# EAGLE design ESP8266-EVB-BAT_Rev_B (EAGLE 4.16)
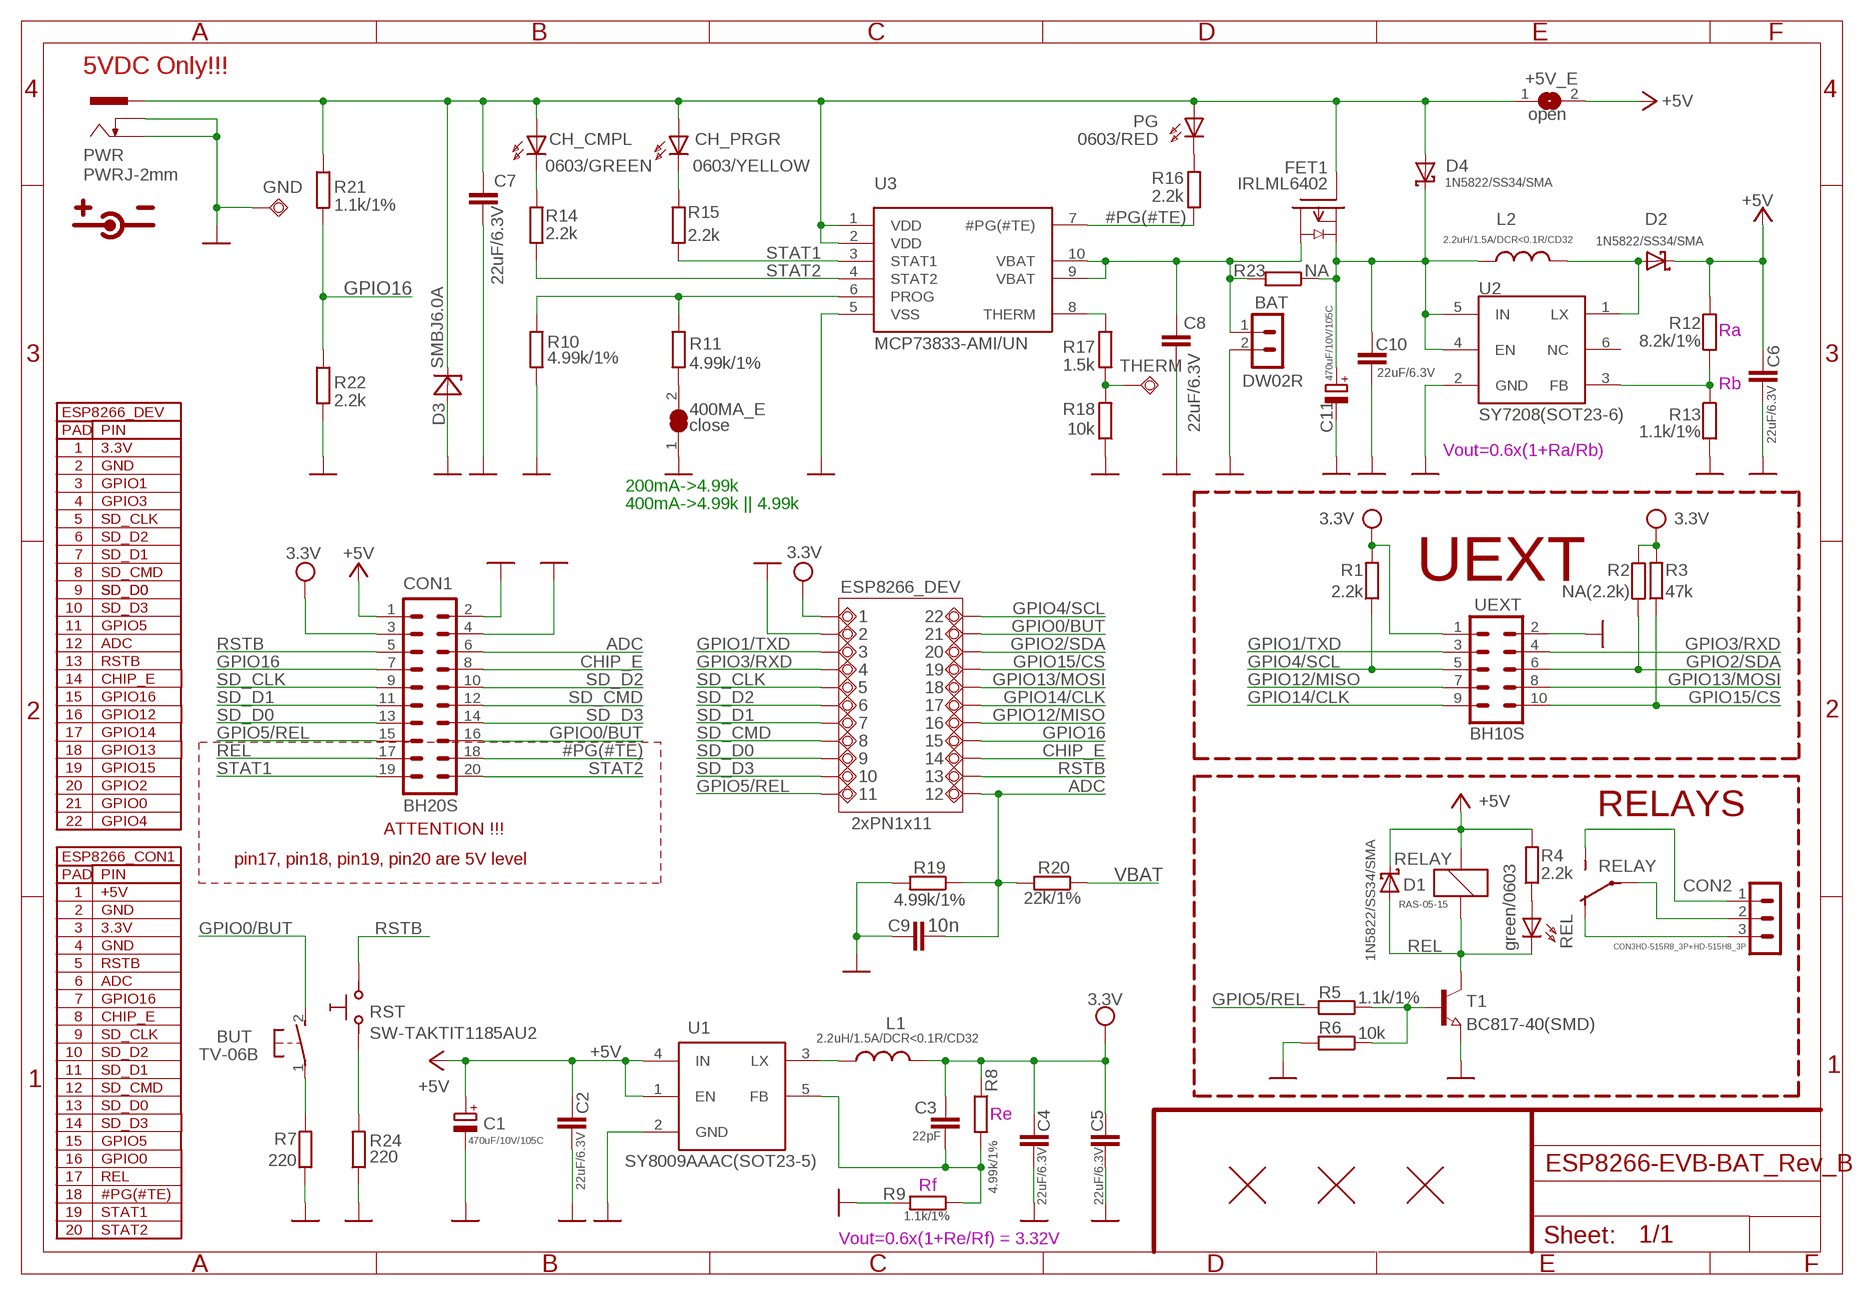
[diagram p0: schematic, sheet 1]

## Parts
1  TESTPAD40/60/SQUARE  [TESTPAD40/66/SQUARE]
2  TESTPAD40/66  [TESTPAD40/66]
3  TESTPAD40/66  [TESTPAD40/66]
4  TESTPAD40/66  [TESTPAD40/66]
5  TESTPAD40/66  [TESTPAD40/66]
6  TESTPAD40/66  [TESTPAD40/66]
7  TESTPAD40/66  [TESTPAD40/66]
8  TESTPAD40/66  [TESTPAD40/66]
9  TESTPAD40/66  [TESTPAD40/66]
10  TESTPAD40/66  [TESTPAD40/66]
11  TESTPAD40/66  [TESTPAD40/66]
12  TESTPAD40/66  [TESTPAD40/66]
13  TESTPAD40/66  [TESTPAD40/66]
14  TESTPAD40/66  [TESTPAD40/66]
15  TESTPAD40/66  [TESTPAD40/66]
16  TESTPAD40/66  [TESTPAD40/66]
17  TESTPAD40/66  [TESTPAD40/66]
18  TESTPAD40/66  [TESTPAD40/66]
19  TESTPAD40/66  [TESTPAD40/66]
20  TESTPAD40/66  [TESTPAD40/66]
21  TESTPAD40/66  [TESTPAD40/66]
22  TESTPAD40/66  [TESTPAD40/66]
400MA_E  close  SJSJ_1_SMALLER_CLOSE_10MILS  [SJ_1_SMALLER_CLOSE_10MILS]
+5V_E  open  SJSJ_SMALLER  [SJ_1_SMALLER]
BAT  DW02R  CON2DW02R  [DW02R]
BUT  TV-06B  31-XX  [B3F-31XX]
C1  470uF/10V/105C  CPOL-EUE2.5-6.3  [E2,5-6,3]
C2  22uF/6.3V  C-EUC0603_DWS  [C0603_DWS]
C3  22pF  C-EUC0603_DWS  [C0603_DWS]
C4  22uF/6.3V  C-EUC0603_DWS  [C0603_DWS]
C5  22uF/6.3V  C-EUC0603_DWS  [C0603_DWS]
C6  22uF/6.3V  C-EUC0603_DWS  [C0603_DWS]
C7  22uF/6.3V  C-EUC0603_DWS  [C0603_DWS]
C8  22uF/6.3V  C-EUC0603_DWS  [C0603_DWS]
C9  10n  C-EUC0603_DWS  [C0603_DWS]
C10  22uF/6.3V  C-EUC0603_DWS  [C0603_DWS]
C11  470uF/10V/105C  CPOL-EUE2.5-6.3  [E2,5-6,3]
CH_CMPL  0603/GREEN  LED0603DWS_L  [LED-0603_L]
CH_PRGR  0603/YELLOW  LED0603DWS_L  [LED-0603_L]
CON1  BH20S  ML20CHANGED  [ML20L_PADS_CHANGED]
CON2  CON3HD-515R8_3P+HD-515H8_3P  [HD-515R8_3P]
D1  1N5822/SS34/SMA  SCHOTKKY7.62SS2  [MLL-41]
D2  1N5822/SS34/SMA  SCHOTKKY7.62SS2  [MLL-41]
D3  SMBJ6.0A  SMBJ16A  [DO214AA]
D4  1N5822/SS34/SMA  SCHOTKKY7.62SS2  [MLL-41]
FET1  IRLML6402  [SOT23]
GND  TESTPAD3  [TEST_PAD40/70/SQUARE]
L1  2.2uH/1.5A/DCR<0.1R/CD32  L-CD32  [CD32]
L2  2.2uH/1.5A/DCR<0.1R/CD32  L-CD32  [CD32]
PG  0603/RED  LED0603DWS_L  [LED-0603_L]
PWR  PWRJ-2mm  PWR-JAKPWR_JACK_UNI_MILLING  [PWR_JACK_UNI_MILLING]
R1  2.2k  R-EU_R0603_5MIL_DWS  [R0603_5MIL_DWS]
R2  NA(2.2k)  R-EU_R0603_5MIL_DWS  [R0603_5MIL_DWS]
R3  47k  R-EU_R0603_5MIL_DWS  [R0603_5MIL_DWS]
R4  2.2k  R-EU_R0603_5MIL_DWS  [R0603_5MIL_DWS]
R5  1.1k/1%  R-EU_R0603_5MIL_DWS  [R0603_5MIL_DWS]
R6  10k  R-EU_R0603_5MIL_DWS  [R0603_5MIL_DWS]
R7  220  R-EU_R0603_5MIL_DWS  [R0603_5MIL_DWS]
R8  4.99k/1%  R-EU_R0603_5MIL_DWS  [R0603_5MIL_DWS]
R9  1.1k/1%  R-EU_R0603_5MIL_DWS  [R0603_5MIL_DWS]
R10  4.99k/1%  R-EU_R0603_5MIL_DWS  [R0603_5MIL_DWS]
R11  4.99k/1%  R-EU_R0603_5MIL_DWS  [R0603_5MIL_DWS]
R12  8.2k/1%  R-EU_R0603_5MIL_DWS  [R0603_5MIL_DWS]
R13  1.1k/1%  R-EU_R0603_5MIL_DWS  [R0603_5MIL_DWS]
R14  2.2k  R-EU_R0603_5MIL_DWS  [R0603_5MIL_DWS]
R15  2.2k  R-EU_R0603_5MIL_DWS  [R0603_5MIL_DWS]
R16  2.2k  R-EU_R0603_5MIL_DWS  [R0603_5MIL_DWS]
R17  1.5k  R-EU_R0603_5MIL_DWS  [R0603_5MIL_DWS]
R18  10k  R-EU_R0603_5MIL_DWS  [R0603_5MIL_DWS]
R19  4.99k/1%  R-EU_R0603_5MIL_DWS  [R0603_5MIL_DWS]
R20  22k/1%  R-EU_R0603_5MIL_DWS  [R0603_5MIL_DWS]
R21  1.1k/1%  R-EU_R0603_5MIL_DWS  [R0603_5MIL_DWS]
R22  2.2k  R-EU_R0603_5MIL_DWS  [R0603_5MIL_DWS]
R23  NA  R-EU_R0603_5MIL_DWS  [R0603_5MIL_DWS]
R24  220  R-EU_R0603_5MIL_DWS  [R0603_5MIL_DWS]
REL  green/0603  LED0603DWS_L  [LED-0603_L]
RELAY  RAS-05-15  RELAYH200F  [H200-FAT]
RST  SW-TAKTIT1185AU2  [IT1185AU2]
T1  BC817-40(SMD)  NPN-TRANSISTOR_SOT23  [SOT23]
THERM  TESTPAD  [TESTPAD34/60]
U1  SY8009AAAC(SOT23-5)  SY8008  [SOT23-5]
U2  SY7208(SOT23-6)  SY7208  [SOT23-6]
U3  MCP73833-AMI/UN  MCP73833  [MSOP10]
U$1  FIDUCIAL  [FIDUCIAL-1X3]
U$2  FIDUCIAL  [FIDUCIAL-1X3]
U$8  FIDUCIAL  [FIDUCIAL-1X3]
UEXT  BH10S  ML10SMD  [ML10_PADS]

## Nets
#PG(#TE): CON1.18 R16.1 U3.7(#PG(#TE))
+5V: +5V_E.2 C1.+ C2.1 C6.1 CON1.1 D1.K(C) D2.K(C) R4.2 R12.2 RELAY.1 U1.1(EN) U1.4(IN)
ADC: 12.P$1(PP) C9.2 CON1.6 R19.1 R20.2
CHIP_E: 14.P$1(PP) CON1.8
COM [REL]: CON2.2 RELAY.P(CONTACTS:P)
GND: 2.P$1(PP) 400MA_E.1 BAT.2 C1.- C2.2 C4.2 C5.2 C6.2 C7.2 C8.2 C9.1 C10.2 C11.- CON1.2 CON1.4 D3.A GND.P$1(PP) PWR.- PWR.-- R6.2 R7.1 R9.2 R10.1 R13.2 R18.1 R19.2 R22.1 R24.1 T1.2(E) U1.2(GND) U2.2(GND) U3.5(VSS) UEXT.2
GPIO0/BUT: 21.P$1(PP) BUT.2(S) CON1.16
GPIO1/TXD: 3.P$1(PP) UEXT.3
GPIO2/SDA: 20.P$1(PP) R2.1 UEXT.6
GPIO3/RXD: 4.P$1(PP) UEXT.4
GPIO4/SCL: 22.P$1(PP) R1.1 UEXT.5
GPIO5/REL: 11.P$1(PP) CON1.15 R5.2
GPIO12/MISO: 16.P$1(PP) UEXT.7
GPIO13/MOSI: 18.P$1(PP) UEXT.8
GPIO14/CLK: 17.P$1(PP) UEXT.9
GPIO15/CS: 19.P$1(PP) R3.1 UEXT.10
GPIO16: 15.P$1(PP) CON1.7 R21.1 R22.2
N$1: R4.1 REL.A
N$2: C10.1 C11.+ D4.K(C) FET1.2(S) L2.1 R23.1 U2.4(EN) U2.5(IN)
N$3: +5V_E.1 C7.1 CH_CMPL.A CH_PRGR.A D3.C D4.A FET1.1(G) PG.A PWR.+ R21.2 U3.1(VDD) U3.2(VDD)
N$4: R24.2 RST.1
N$21: CH_CMPL.C R14.2
N$23: CH_PRGR.C R15.2
N$25: PG.C R16.2
N$26: R5.1 R6.1 T1.1(B)
N$28: R17.2 U3.8(THERM)
N$29: BUT.1(P) R7.2
N$30: R17.1 R18.2 THERM.P$1(PP)
N$32: 400MA_E.2 R11.1
N$33: R10.2 R11.2 U3.6(PROG)
N$64: L1.1 U1.3(LX)
N$66: C3.2 R8.2 R9.1 U1.5(FB)
N$123: D2.A L2.2 U2.1(LX)
N$126: R12.1 R13.1 U2.3(FB)
NC [REL]: CON2.3 RELAY.O(CONTACTS:O)
NO [REL]: CON2.1 RELAY.S(CONTACTS:S)
REL [pwr2]: CON1.17 D1.A REL.C RELAY.2 T1.3(C)
RSTB: 13.P$1(PP) CON1.5 RST.2
SD_CLK: 5.P$1(PP) CON1.9
SD_CMD: 8.P$1(PP) CON1.12
SD_D0: 9.P$1(PP) CON1.13
SD_D1: 7.P$1(PP) CON1.11
SD_D2: 6.P$1(PP) CON1.10
SD_D3: 10.P$1(PP) CON1.14
STAT1: CON1.19 R15.1 U3.3(STAT1)
STAT2: CON1.20 R14.1 U3.4(STAT2)
VBAT: BAT.1 C8.1 FET1.3(D) R20.1 R23.2 U3.9(VBAT) U3.10(VBAT)
VCC: 1.P$1(PP) C3.1 C4.1 C5.1 CON1.3 L1.2 R1.2 R2.2 R3.2 R8.1 UEXT.1 ; supply symbol labelled 3.3V
Unconnected: U2.6(NC)

## Notes on the sheet
- 5VDC Only!!!
- Ra
- Rb
- ESP8266_DEV
- PAD | PIN
- 1 | 3.3V | Vout=0.6x(1+Ra/Rb)
- 2 | GND
- 3 | GPIO1 | 200mA->4.99k
- 4 | GPIO3 | 400mA->4.99k || 4.99k
- 5 | SD_CLK
- 6 | SD_D2
- 7 | SD_D1
- 8 | SD_CMD | UEXT
- 9 | SD_D0 | SD_D0 | ESP8266_DEV
- 10 | SD_D3
- 11 | GPIO5
- 12 | ADC
- 13 | RSTB
- 14 | CHIP_E
- 15 | GPIO16
- 16 | GPIO12
- 17 | GPIO14
- 18 | GPIO13
- 19 | GPIO15
- 20 | GPIO2
- 21 | GPIO0
- RELAYS
- 22 | GPIO4 | 2xPN1x11
- ATTENTION !!!
- ESP8266_CON1 | pin17, pin18, pin19, pin20 are 5V level
- PAD | PIN
- 1 | +5V
- 2 | GND
- 3 | 3.3V
- 4 | GND
- 5 | RSTB
- 6 | ADC
- 7 | GPIO16
- 8 | CHIP_E
- 9 | SD_CLK
- 10 | SD_D2
- 11 | SD_D1
- 12 | SD_CMD
- 13 | SD_D0
- Re
- 14 | SD_D3
- 15 | GPIO5
- 16 | GPIO0
- 17 | REL
- Rf
- 18 | #PG(#TE)
- 19 | STAT1
- 20 | STAT2
- Vout=0.6x(1+Re/Rf) = 3.32V

## Library data of the parts
1-22 GND = gogo:TESTPAD: drill 40mils, diameter 70mils
400MA_E +5V_E = jumper:SJ: SMD solder JUMPER
BAT = Penko:CON2
BUT = switch-omron:31-XX: OMRON SWITCH
C1 C11 = rcl:CPOL-EU: POLARIZED CAPACITOR, European symbol
C2-C10 = rcl:C-EU: CAPACITOR, European symbol
CH_CMPL CH_PRGR PG REL = DOUBLE-SIDE:LED
CON1 = con-harting-ml:ML20: HARTING
CON2 = Penko:CON3
D1 D2 D4 = gogo:SCHOTKKY7.62SS
D3 = OLIMEX_DISCRET:SMBJ16A
FET1 = gogo:IRLML6402
L1 L2 = OLIMEX_DISCRET:L
PWR = gogo:PWR-JAK
R1-R24 = rcl:R-EU_: RESISTOR, European symbol
RELAY = DOUBLE-SIDE:RELAY: RELAY
RST = gogo:SW-TAKT
T1 = semicon-smd-ipc:NPN-TRANSISTOR_: NPN TRANSISTOR
THERM = IP4w:TESTPAD
U1 = OLIMEX_IC:SY8008
U2 = OLIMEX_IC:SY7208
U3 = OLIMEX_IC:MCP73833
U$1 U$2 U$8 = SparkFunEagle-6-6-07:FIDUCIAL: Fiducial Alignment Points Various fiducial points for machine vision alignment.
UEXT = con-harting-ml:ML10: HARTING

## Net classes
4 REL: width 2.032 mm, drill 2.54 mm

## Board
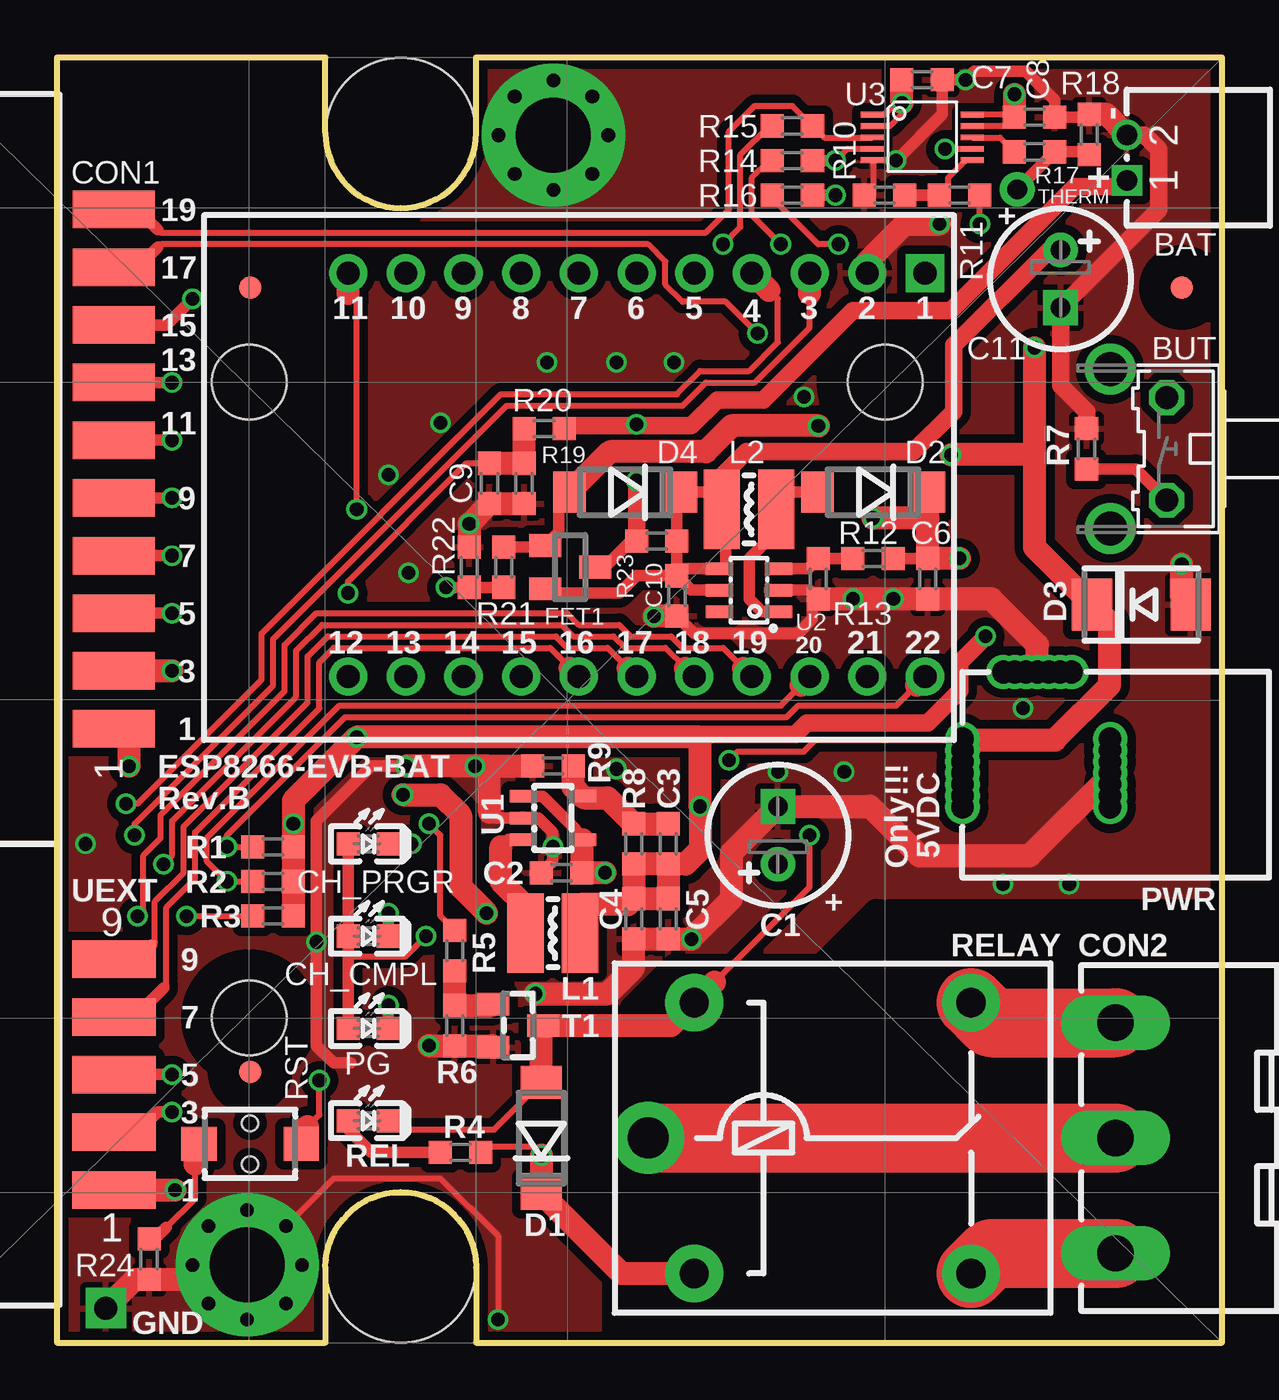
[diagram p1: board, top side]
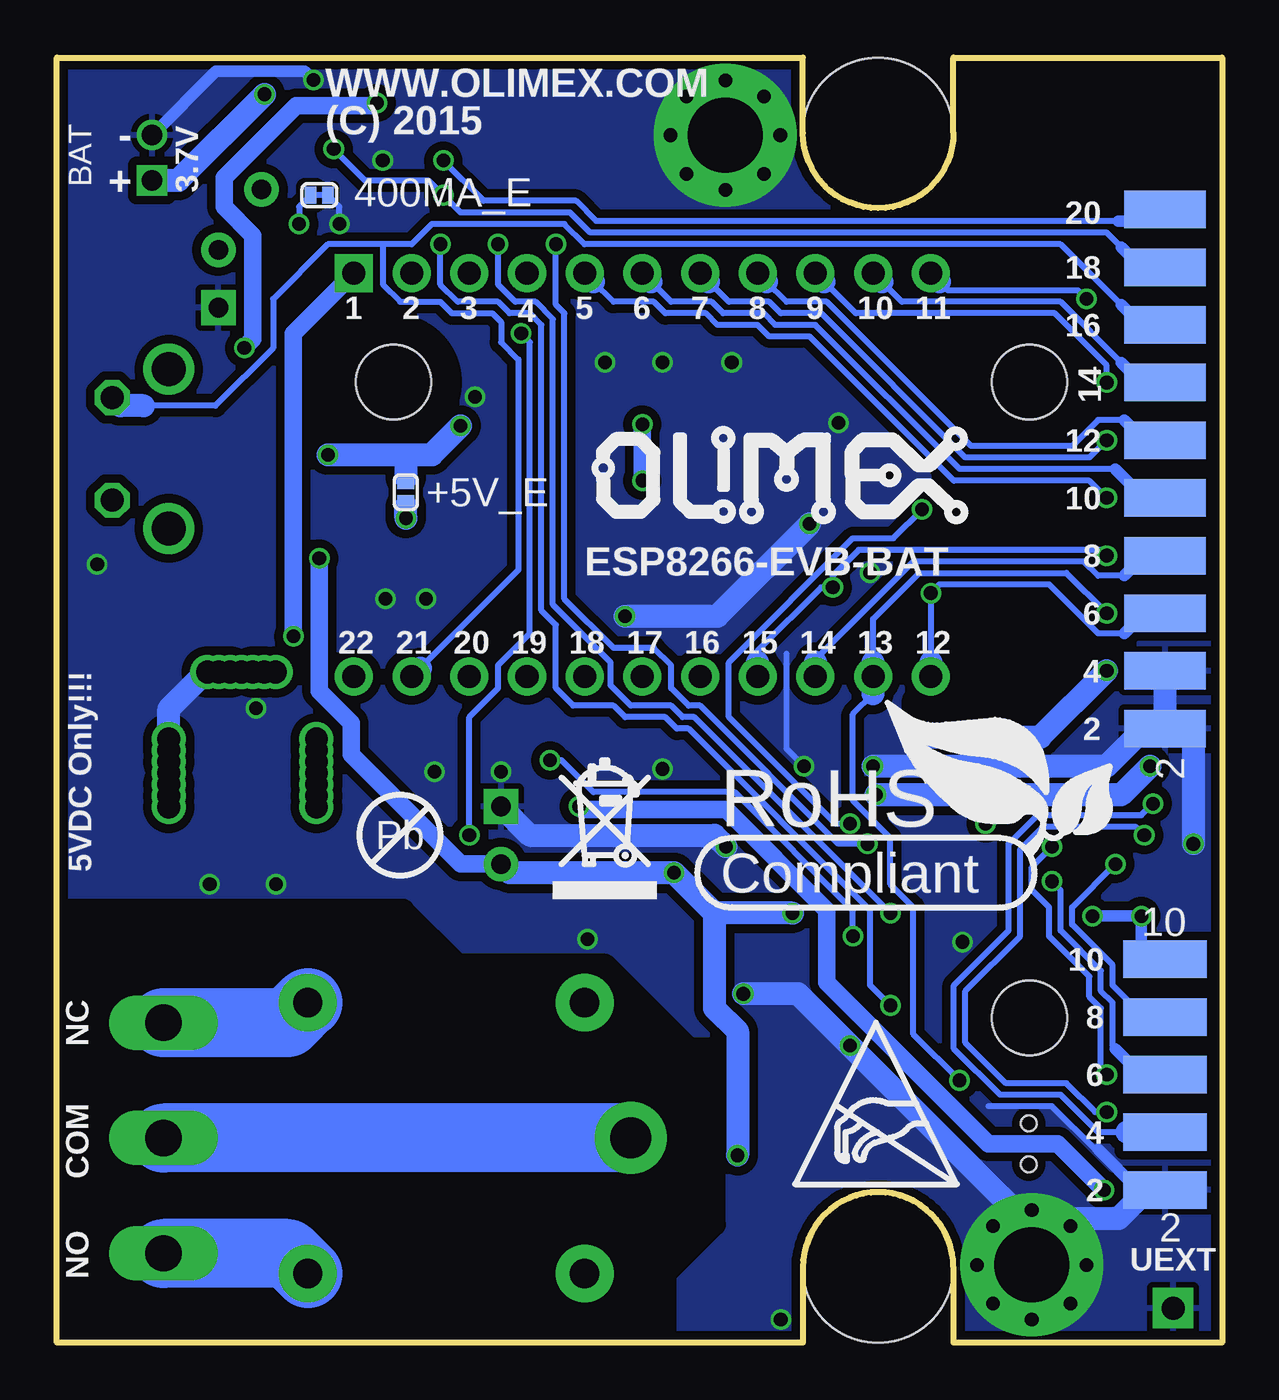
[diagram p2: board, bottom side, seen from below]

Size 51.31 x 56.61 mm. Coordinates in mm from the lower left corner, seen from the top.
Copper layers (1+16): Top 0.035mm / dielectric 1.5mm / Bottom 0.035mm
Design rules "default": minimum track width 5mil, minimum drill 0.3mm, track to track 5mil, track to pad 5mil, pad to pad 5mil, via to via 5mil, smd to smd 1mil, copper to edge 5mil, drill to drill 8mil, minimum pad ring 6mil, minimum via ring 6mil, stop-mask expansion 2mil, vias tented up to drill 25mil, thermal gap 10mil
tRestrict: 22 lines
bRestrict: 22 lines

### Footprints (pad centres in the part's own frame; a part is rotated, then mirrored left to right if it is on the bottom)
TESTPAD40/66/SQUARE = drill 1.016 pad 1.676 square: P$1 0,0
TESTPAD40/66 = drill 1.016 pad 1.676 round: P$1 0,0
SJ_1_SMALLER_CLOSE_10MILS = smd 0.508 x 0.762: 1 -0.381,0; 2 0.381,0
SJ_1_SMALLER = smd 0.508 x 0.762: 1 -0.381,0; 2 0.381,0
DW02R = drill 0.9 square: 1 -1,0 | drill 0.9 round: 2 1,0
B3F-31XX = drill 1.016 octagon: 1 -2.261,-1.245; 2 2.261,-1.245 | drill 1.499 pad 2.159 round: 3 -3.505,1.245; 4 3.505,1.245
E2,5-6,3 = drill 0.864 pad 1.524 round: + -1.27,0 | drill 0.864 pad 1.524 square: - 1.27,0
C0603_DWS = smd 1.016 x 1.016: 1 -0.889,0; 2 0.889,0
LED-0603_L = smd 1.016 x 1.016: A 0.889,0; C -0.889,0
ML20L_PADS_CHANGED = smd 1.651 x 3.607: 1 -11.43,-3.404; 3 -8.89,-3.404; 5 -6.35,-3.404; 7 -3.81,-3.404; 9 -1.27,-3.404; 11 1.27,-3.404; 13 3.81,-3.404; 15 6.35,-3.404; 17 8.89,-3.404; 19 11.43,-3.404 | smd 1.651 x 3.607 bottom: 2 -11.43,-3.404; 4 -8.89,-3.404; 6 -6.35,-3.404; 8 -3.81,-3.404; 10 -1.27,-3.404; 12 1.27,-3.404; 14 3.81,-3.404; 16 6.35,-3.404; 18 8.89,-3.404; 20 11.43,-3.404
HD-515R8_3P = drill 1.6 long: 1 -5.08,8.25; 2 0,8.25; 3 5.08,8.25
MLL-41 = smd 1.45 x 1.8: A 2.445,0; K -2.445,0
DO214AA = smd 1.778 x 2.286: A 2.177,0; C -2.177,0
SOT23 = smd 1 x 1.4: 1 -0.95,-1.1; 2 0.95,-1.1; 3 0,1.1
TEST_PAD40/70/SQUARE = drill 1.016 pad 1.778 square: P$1 0,0
CD32 = smd 1.6 x 3.5: 1 -1.2,0; 2 1.2,0
PWR_JACK_UNI_MILLING = drill 1 round: + 0,4.75; +1 0,5.25; +2 0,5.75; +3 0,6.25; +4 0,4.25; +5 0,3.75; +6 0,3.25; - -6.5,4.75; -1 -6.5,5.25; -2 -6.5,5.75; -3 -6.5,4.25; -4 -6.5,3.75; -5 -6.5,6.25; -6 -6.5,3.25; -- -3.3,0.3; --1 -3.8,0.3; --2 -4.3,0.3; --3 -4.8,0.3; --4 -2.8,0.3; --5 -2.3,0.3; --6 -1.8,0.3
R0603_5MIL_DWS = smd 1.016 x 1.016: 1 -0.889,0; 2 0.889,0
H200-FAT = drill 1.295 pad 2.54 round: 1 -7.493,-5.969; 2 -7.493,5.969; O 4.699,5.969; S 4.699,-5.969 | drill 1.803 pad 3.175 round: P -9.525,0
IT1185AU2 = smd 1.55 x 1.5: 1 -2.25,0; 2 2.25,0 | hole 0.7: 0,-0.9; 0,0.9
SOT23' = smd 1.4 x 1: 1 1.1,-0.95; 2 1.1,0.95; 3 -1.1,0
TESTPAD34/60 = drill 0.864 pad 1.524 round: P$1 0,0
SOT23-5 = smd 1.2 x 0.55: 1 1.3,-0.95; 2 1.3,0; 3 1.3,0.95; 4 -1.3,0.95; 5 -1.3,-0.95
SOT23-6 = smd 1.2 x 0.55: 1 1.3,-0.95; 2 1.3,0; 3 1.3,0.95; 4 -1.3,0.95; 5 -1.3,0; 6 -1.3,-0.95
MSOP10 = smd 1.016 x 0.254: 1 -2.2,1; 2 -2.2,0.5; 3 -2.2,0; 4 -2.2,-0.5; 5 -2.2,-1; 6 2.2,-1; 7 2.2,-0.5; 8 2.2,0; 9 2.2,0.5; 10 2.2,1
FIDUCIAL-1X3 = smd 1 x 1: 1 0,0
HAMMOND_1593KBK_ESP8266_EVB-BAT = hole 3.3: 8.48,14.31; 36.48,42.31; 8.48,42.31 | hole 6.6: 15.15,3.3; 15.15,53.3
ML10_PADS = smd 1.651 x 3.683: 1 -5.08,-0.229; 3 -2.54,-0.229; 5 0,-0.229; 7 2.54,-0.229; 9 5.08,-0.229 | smd 1.651 x 3.683 bottom: 2 -5.08,-0.229; 4 -2.54,-0.229; 6 0,-0.229; 8 2.54,-0.229; 10 5.08,-0.229

### Placement (x,y rotation side)
1  38.23,47.12 270 top
2  35.69,47.12 270 top
3  33.15,47.12 270 top
4  30.61,47.12 270 top
5  28.07,47.12 270 top
6  25.53,47.12 270 top
7  22.99,47.12 270 top
8  20.45,47.12 270 top
9  17.91,47.12 270 top
10  15.37,47.12 270 top
11  12.83,47.12 270 top
12  12.83,29.34 270 top
13  15.37,29.34 270 top
14  17.91,29.34 270 top
15  20.45,29.34 270 top
16  22.99,29.34 270 top
17  25.53,29.34 270 top
18  28.07,29.34 270 top
19  30.61,29.34 270 top
20  33.15,29.34 270 top
21  35.69,29.34 270 top
22  38.23,29.34 270 top
400MA_E  39.75,50.55 180 bottom
+5V_E  35.94,37.47 270 bottom
BAT  47.12,52.2 90 top
BUT  47.62,39.37 90 top
C1  31.75,22.35 90 top
C2  22.23,20.7 180 top
C3  26.92,21.97 90 top
C4  25.4,18.67 270 top
C5  26.92,18.67 270 top
C6  38.35,33.66 270 top
C7  38.1,55.63 0 top
C8  43.05,53.98 0 top
C9  19.05,37.85 90 top
C10  27.3,32.89 270 top
C11  44.2,46.86 270 top
CH_CMPL  13.72,17.91 180 top
CH_PRGR  13.72,21.97 180 top
CON1  -0.89,38.48 90 top
CON2  54.86,9.02 90 top
D1  21.34,9.02 90 top
D2  35.94,37.47 180 top
D3  47.75,32.51 0 top
D4  25.02,37.47 180 top
FET1  22.61,34.16 270 top
GND  2.16,1.52 180 top
L1  21.84,18.03 0 top
L2  30.48,36.7 0 top
PG  13.72,13.84 180 top
PWR  39.88,29.84 180 top
R1  9.53,21.84 0 top
R2  9.53,20.32 0 top
R3  9.53,18.8 0 top
R4  17.78,8.38 0 top
R5  17.53,17.27 90 top
R6  17.53,13.97 270 top
R7  45.34,39.37 270 top
R8  25.4,21.97 90 top
R9  21.84,25.4 180 top
R10  36.45,50.55 0 top
R11  39.75,50.55 180 top
R12  35.94,34.54 0 top
R13  33.53,33.66 270 top
R14  32.38,52.07 180 top
R15  32.38,53.59 180 top
R16  32.38,50.55 180 top
R17  43.05,52.45 180 top
R18  45.47,53.21 270 top
R19  20.57,37.85 270 top
R20  21.46,40.26 180 top
R21  19.68,34.16 90 top
R22  18.16,34.16 270 top
R23  26.42,35.31 180 top
R24  4.06,3.68 90 top
REL  13.72,9.78 180 top
RELAY  35.56,9.02 0 top
RST  8.51,8.76 0 top
T1  BC817-40(SMD)  [SOT23']  20.32,13.97 180 top
THERM  42.29,50.8 0 top
U1  21.84,23.11 180 top
U2  30.48,33.15 0 top
U3  38.1,53.09 0 top
U$1  8.51,11.94 180 top
U$2  8.51,46.48 180 top
U$4  [ESD_SYMBOL]  18.8,6.99 0 bottom
U$5  [HAMMOND_1593KBK_ESP8266_EVB-BAT]  0,0 0 top
U$6  [PB_SMALL]  36.2,22.35 180 bottom
U$7  [RECYCLE_BIN1/8]  29.46,19.56 0 bottom
U$8  49.53,46.48 0 top
U$9  [ROHS]  22.1,19.81 0 bottom
U$10  [OLIMEX1_V]  10.03,35.94 0 bottom
UEXT  2.29,11.81 90 top

### Tracks (layer width: path | path; a pad name or v marks a point on that pad's centre or on a via)
#PG(#TE)  (via drill 0.6)
  Top 0.254: v39.12,52.58 v39.12,52.59 U3.7
  Top 0.508: v34.29,50.55 R16.1
  Bottom 0.254: v39.12,52.58 37.72,51.18 34.92,51.18 v34.29,50.55 33.53,49.78 28.7,49.78 27.81,48.9 5.08,48.9 4.45,48.26
  Bottom 0.508: CON1.18 3.56,47.37 4.45,48.26
+5V  (via drill 0.6)
  Top 0.254: R4.2 18.92,8.64 20.95,8.64 v21.34,8.26
  Top 0.508: U1.4 22.86,22.45 22.86,22.61 21.4,24.06 U1.1 | C6.1 R12.2
  Top 1.016: 23.14,20.7 C2.1 | 23.14,20.7 U1.4 | v24.13,20.7 23.14,20.7 | RELAY.1 24.86,3.05 D1.K v21.34,8.26 | 38.35,36.32 C6.1 v39.75,34.54 | 38.35,36.32 38.35,37.43 D2.K | 38.35,36.32 v35.94,36.32 | v18.92,18.92 17.78,20.07 17.78,23.24 16.89,24.13 v15.24,24.13 | v3.17,25.4 3.17,27.05 CON1.1
  Bottom 0.508: 35.94,36.83 +5V_E.2
  Bottom 0.762: C1.+ 33.53,21.08 38.35,25.91 38.35,27.3 39.75,28.7 v39.75,34.54
  Bottom 1.016: v21.34,8.26 21.34,13.72 22.35,14.73 22.35,18.92 | 22.35,18.92 v24.13,20.7 31.37,20.7 C1.+ | v35.94,36.32 35.94,36.83 | v15.24,24.13 4.45,24.13 v3.17,25.4 | v18.92,18.92 22.35,18.92
ADC  (via drill 0.6)
  Top 0.254: v12.83,33.02 12.83,33.53 18.03,38.73 C9.2
  Top 1.016: R20.2 R19.1 C9.2
  Bottom 0.254: CON1.6 3.43,32.13 | 12.83,29.97 v12.83,33.02 12.45,33.4 7.62,33.4 5.46,31.24 4.32,31.24
  Bottom 0.508: 3.43,32.13 4.32,31.24
  Bottom 1.016: 12.83,29.97 12.P$1
CHIP_E
  Bottom 0.254: CON1.8 3.43,34.67 | 4.32,33.78 5.46,33.78 6.1,34.42 13.59,34.42 17.91,30.1 17.91,29.97
  Bottom 0.508: 3.43,34.67 4.32,33.78
  Bottom 1.016: 17.91,29.97 14.P$1
COM
  Top 3.048: RELAY.P CON2.2
  Bottom 3.048: RELAY.P CON2.2
GND  (via drill 0.6, 3.3 pad 6.3)
  Top 0.254: 36.45,52.09 36.94,52.09 v36.96,52.07 | 36.45,52.09 U3.5 | R10.1 35.94,50.55 35.94,52.09 36.45,52.09 | v10.09,5.13 12.19,7.24 16.89,7.24 19.43,4.7 v19.43,1.02
  Top 0.508: 19.05,23.37 19.3,23.11 U1.2 21.21,23.11 21.84,22.48 v21.84,21.84 21.84,21.21 C2.2 | R18.1 45.34,53.98 C8.2 43.94,54.74 42.67,56.01 40.39,56.01 v40.01,55.63 C7.2 38.99,54.1 v36.96,52.07 | U2.2 33.15,33.15 R13.2 33.27,32.51 33.27,31.88 32.64,31.24 28.07,31.24 C10.2 | v15.37,25.4 13.84,25.4 11.43,22.99 v11.43,17.65 11.43,13.08 12.19,12.32 12.95,12.32
  Top 0.762: BAT.2 47.9,53.2 48.51,52.58 48.51,49.91 C11.- 44.2,42.16 45.34,41.02 R7.1
  Top 1.016: T1.2 19.16,13.08 R6.2 v16.38,13.08 | 19.05,25.4 R9.2 | 19.05,23.37 19.05,25.4 | 19.05,25.4 v18.41,25.4 v15.37,25.4 | BAT.2 46.21,54.1 R18.1 | C10.2 v26.29,32 | R13.2 v35.05,32.77 v36.83,32.77 C6.2 41.15,32.77 43.18,30.74 PWR.-- | PWR.- 46.38,25 42.84,21.46 37.97,21.46 35.81,23.62 C1.- 29.72,21.59 29.72,19.56 v27.94,17.78 C5.2 C4.2 25.4,16.51 24.26,15.37 v21.08,15.37 | R22.1 v18.16,36.07 C9.1 R19.2 | 2.P$1 35.69,47.62 37.34,49.28 v38.86,49.28 | v8.38,1.02 7.38,1.02 v6.68,1.72 5.97,2.43 v5.97,3.43 | v8.38,1.02 9.38,1.02 v10.09,1.72 10.79,2.43 v10.79,3.43 | v5.97,3.43 5.97,4.43 v6.68,5.13 7.38,5.84 v8.38,5.84 | v10.79,3.43 10.79,4.43 v10.09,5.13 9.38,5.84 v8.38,5.84 | v8.38,3.43 v8.38,5.84 | v8.38,3.43 v8.38,1.02 | v5.97,3.43 v8.38,3.43 | v8.38,3.43 v10.79,3.43 | v21.87,50.77 20.87,50.77 v20.16,51.48 19.46,52.19 v19.46,53.19 | v21.87,50.77 22.87,50.77 v23.58,51.48 24.28,52.19 v24.28,53.19 | v19.46,53.19 19.46,54.19 v20.16,54.89 20.87,55.6 v21.87,55.6 | v24.28,53.19 24.28,54.19 v23.58,54.89 22.87,55.6 v21.87,55.6 | v21.87,53.19 v21.87,55.6 | v21.87,50.77 v21.87,53.19 | v19.46,53.19 v21.87,53.19 | v21.87,53.19 v24.28,53.19 | D3.A 49.53,32.91 v49.53,34.29 | v5.97,3.43 5.97,2.79 R24.1 3.43,2.79 GND.P$1
  Bottom 0.254: 400MA_E.1 38.86,50.04 v38.86,49.28 | 5.46,8.51 5.59,8.51 7.49,10.41 10.29,10.41 | v18.41,25.4 19.18,26.16 19.18,30.35
  Bottom 0.508: v40.01,55.63 40.39,56.01 44.31,56.01 BAT.2 | 3.3,6.73 3.68,6.73 5.46,8.51
  Bottom 1.016: C1.- 30.48,22.35 22.35,22.35 v21.84,21.84 | PWR.-- 44.75,29.55 46.38,27.92 PWR.- | v21.08,15.37 18.67,15.37 v16.38,13.08 8.76,5.46 4.57,5.46 3.3,6.73 UEXT.2 | CON1.2 CON1.4 | v15.37,25.4 5.08,25.4 3.43,27.05 CON1.2 | v18.16,36.07 22.23,32 v26.29,32 | CON1.2 1.27,27.05 v1.27,21.97
  other vias: 41.66,20.19 44.58,20.19 24.64,25.27 31.75,25.15 14.61,38.23 16.89,40.51 24.64,43.18 27.18,43.18 21.59,43.18 32.89,41.66 42.55,27.94 34.67,25.15 15.49,33.91
  pour Top (isolate 0.381): -2.54,-2.54 -2.54,59.18 53.85,59.18 53.85,-2.54
  pour Bottom (isolate 0.381): 56.39,-5.08 -5.08,-5.08 -5.08,61.72 56.39,61.72
GPIO0/BUT
  Bottom 0.254: 4.45,45.72 7.11,48.39 28.07,48.39 28.96,49.28 34.8,49.28 35.69,48.39 36.96,48.39 | CON1.16 3.56,44.83 | 36.96,48.39 39.37,48.39 41.78,45.97 41.78,43.81 44.32,41.27 47.5,41.27 | 35.31,29.72 30.99,34.04 30.99,43.31 31.75,44.07 31.75,44.96 32.13,45.34 33.91,45.34 34.42,45.85 36.2,45.85 36.96,46.61 36.96,48.39
  Bottom 0.508: 3.56,44.83 4.45,45.72
  Bottom 1.016: 35.31,29.72 21.P$1 | 47.5,41.27 48.51,41.27 BUT.2
GPIO1/TXD  (via drill 0.6)
  Top 0.254: 33.15,46.23 33.15,44.7 30.73,42.29 28.57,42.29 27.56,41.27 19.81,41.27 9.53,30.99 9.53,28.96 3.43,22.86 v3.43,22.35 | UEXT.3 3.56,9.27
  Top 0.508: 3.56,9.27 4.45,10.16 v5.08,10.16
  Top 1.016: 33.15,46.23 3.P$1
  Bottom 0.254: v3.43,22.35 3.81,22.73 7.87,22.73 8.89,21.72 8.89,17.91 11.3,15.49 11.3,13.21 9.53,11.43 6.86,11.43 5.59,10.16 v5.08,10.16
GPIO2/SDA  (via drill 0.6)
  Top 0.254: 32.77,28.96 31.88,28.07 12.45,28.07 6.6,22.23 6.6,21.21 v7.49,20.32 R2.1
  Top 1.016: 32.77,28.96 20.P$1
  Bottom 0.254: 4.7,12.95 4.83,13.08 4.83,14.99 5.33,15.49 5.33,16.38 7.11,18.16 7.11,19.94 v7.49,20.32
  Bottom 0.508: UEXT.6 3.56,11.81 4.7,12.95
GPIO3/RXD  (via drill 0.6)
  Top 0.254: 31.37,46.35 31.75,45.97 31.75,44.07 30.48,42.8 28.32,42.8 27.3,41.78 19.56,41.78 9.02,31.24 9.02,29.21 3.56,23.75 v3.05,23.75
  Top 1.016: 31.37,46.35 4.P$1
  Bottom 0.254: v3.05,23.75 3.56,23.24 8.13,23.24 9.4,21.97 9.4,18.16 11.81,15.75 11.81,12.95 9.78,10.92 7.11,10.92 5.46,9.27 4.19,9.27
  Bottom 1.016: UEXT.4 4.19,9.27
GPIO4/SCL  (via drill 0.6)
  Top 0.254: 37.85,28.96 36.96,28.07 32.64,28.07 32.13,27.56 12.7,27.56 7.49,22.35 v7.49,21.84 R1.1
  Top 0.508: UEXT.5 v5.08,11.81
  Top 1.016: 37.85,28.96 22.P$1
  Bottom 0.254: v7.49,21.84 8.38,20.95 8.38,19.94 7.62,19.18 7.62,17.91 5.84,16.13 5.84,15.24 5.33,14.73 5.33,12.06 v5.08,11.81
GPIO5/REL  (via drill 0.6)
  Top 0.254: R5.2 16.89,18.8 16.89,22.35 v16.38,22.86 | v13.21,36.7 13.21,45.85 12.83,46.23
  Top 0.508: v5.97,45.97 4.83,44.83 CON1.15
  Top 1.016: 12.83,46.23 11.P$1
  Bottom 0.254: v16.38,22.86 17.02,22.86 21.72,27.56 21.72,29.97 16.26,35.43 14.48,35.43 v13.21,36.7 | v5.97,45.97 6.35,46.35 12.06,46.35 12.45,46.74
  Bottom 1.016: 11.P$1 12.45,46.74
GPIO12/MISO
  Top 0.254: 22.61,29.72 21.72,30.61 12.19,30.61 11.56,29.97 11.56,27.94 6.1,22.48 6.1,20.45 4.83,19.18 4.83,15.75 4.7,15.62 | UEXT.7 3.43,14.35
  Top 0.508: 3.43,14.35 4.7,15.62
  Top 1.016: 22.61,29.72 16.P$1
GPIO13/MOSI  (via drill 0.6)
  Top 0.254: v4.7,21.08 5.08,21.46 5.08,22.99 10.54,28.45 10.54,30.48 11.68,31.62 22.23,31.62 22.73,31.11 24.51,31.11 25.02,30.61 26.8,30.61 27.69,29.72
  Top 1.016: 27.69,29.72 18.P$1
  Bottom 0.254: UEXT.8 3.43,14.35 4.83,15.75 4.83,16.64 6.6,18.41 6.6,19.18 v4.7,21.08
GPIO14/CLK
  Top 0.254: 25.15,29.72 24.26,30.61 22.48,30.61 21.97,31.11 11.94,31.11 11.05,30.23 11.05,28.19 5.59,22.73 5.59,20.7 4.32,19.43 4.32,17.65 4.19,17.53
  Top 0.508: UEXT.9 3.56,16.89 4.19,17.53
  Top 1.016: 25.15,29.72 17.P$1
GPIO15/CS  (via drill 0.6)
  Top 0.254: 30.23,29.72 29.34,30.61 27.56,30.61 27.05,31.11 25.27,31.11 24.77,31.62 22.99,31.62 22.48,32.13 11.43,32.13 10.03,30.73 10.03,28.7 4.57,23.24 4.57,22.23 3.81,21.46 3.81,19.05 v3.56,18.8 | v5.71,18.8 R3.1
  Top 1.016: 30.23,29.72 19.P$1
  Bottom 0.254: UEXT.10 3.56,16.89
  Bottom 0.508: 3.56,16.89 v3.56,18.8 v5.71,18.8
GPIO16  (via drill 0.6)
  Top 0.508: R21.1 R22.2 v17.14,33.27 | CON1.7 v5.08,34.67
  Bottom 0.254: 20.45,29.97 20.45,30.48 17.65,33.27 v17.14,33.27 17.14,33.78 16,34.92 5.33,34.92 v5.08,34.67
  Bottom 1.016: 20.45,29.97 15.P$1
N$1
  Top 0.508: R4.1 13.84,8.38 12.83,9.4 REL.A
N$2
  Top 0.508: 27.3,34.1 U2.4 29.46,34.1 29.46,36.52 L2.1 29.28,37.47 29.21,37.47 D4.K 27.3,37.47 R23.1 27.3,34.1 | C10.1 27.94,33.15 U2.5 | C10.1 27.3,34.1 | FET1.2 21.7,33.02 24.77,33.02 25.53,33.78 C10.1
  Top 0.762: 29.21,37.47 29.21,38.1 30.35,39.24 37.72,39.24 39.5,41.02 39.5,43.94 43.69,48.13 C11.+
N$3  (via drill 0.6)
  Top 0.254: U3.1 36.43,54.09 36.96,54.61 v37.21,54.61 37.21,54.1 36.7,53.59 U3.2 | v29.59,25.65 29.97,26.04 32.89,26.04 33.4,26.54 39.88,26.54 | v16.26,17.91 15.37,17.02 12.83,17.02
  Top 0.508: PG.A 12.83,17.02 CH_CMPL.A CH_PRGR.A | D4.A 22.1,36.99 22.1,35.7 FET1.1 21.45,35.05 R21.2
  Top 1.016: v37.21,54.61 C7.1 | D4.A 24.35,39.24 28.57,39.24 29.72,40.39 v33.53,40.39 | PWR.+ 39.88,26.54 43.94,26.54 46.35,28.96 46.35,31.73 D3.C 43.05,35.03 43.05,39.12 | 43.05,39.12 v39.37,39.12 | 43.05,39.12 v43.05,43.81
  Bottom 0.254: v29.59,25.65 29.08,25.65 27.69,24.26 21.46,24.26 16.26,19.05 v16.26,17.91
  Bottom 0.508: 35.94,38.1 +5V_E.1
  Bottom 0.762: v37.21,54.61 37.34,54.48 40.77,54.48 43.94,51.31 43.94,50.04 42.67,48.77 42.67,44.2 v43.05,43.81
  Bottom 1.016: v33.53,40.39 34.8,39.12 35.94,39.12 | 35.94,39.12 35.94,38.1 | v39.37,39.12 35.94,39.12
N$4
  Top 0.254: 6.1,7.87 6.1,6.35 4.83,5.08
  Top 0.508: R24.2 4.32,4.57 4.83,5.08
  Top 1.016: RST.1 6.1,8.76 6.1,7.87
N$21  (via drill 0.6)
  Top 0.254: R14.2 31.37,52.07 30.61,51.31 30.61,49.66 v31.88,48.39
  Top 0.508: CH_CMPL.C v14.61,18.92
  Bottom 0.254: v31.88,48.39 31.88,46.61 31.11,45.85 30.23,45.85 29.46,45.09 29.46,32.51 26.92,29.97 26.92,28.96 26.04,28.07 24.26,28.07 23.75,27.56 23.24,27.56 v14.61,18.92
N$23  (via drill 0.6)
  Top 0.254: R15.2 31.37,53.59 30.1,52.32 30.1,49.15 v29.34,48.39
  Top 0.508: CH_PRGR.C v15.62,21.97
  Bottom 0.254: v29.34,48.39 29.34,45.72 28.96,45.34 28.96,32.77 26.8,30.61 25.02,30.61 24.26,29.84 24.26,28.83 23.5,28.07 22.99,28.07 16.89,21.97 v15.62,21.97
N$25  (via drill 0.6)
  Top 0.254: R16.2 31.5,50.42 33.53,48.39 v34.42,48.39
  Top 0.508: PG.C v14.61,14.86
  Bottom 0.254: v34.42,48.39 34.42,46.61 33.66,45.85 31.88,45.85 31.37,45.34 30.48,45.34 29.97,44.83 29.97,32.26 29.34,31.62 29.34,28.83 28.57,28.07 26.8,28.07 26.29,27.56 24.51,27.56 24,27.05 23.5,27.05 15.49,19.05 15.49,15.75 v14.61,14.86
N$26
  Top 1.016: T1.1 19.16,14.86 R6.1 R5.1
N$28
  Top 0.254: U3.8 41.53,53.09 R17.2
N$29
  Top 0.508: BUT.1 47.5,38.48 R7.2
N$30
  Top 0.508: R18.2 45.34,52.45 R17.1 THERM.P$1
N$32  (via drill 0.6)
  Top 0.254: v40.64,49.28 R11.1
  Bottom 0.254: 400MA_E.2 40.64,50.04 v40.64,49.28
N$33
  Top 0.254: U3.6 40.02,52.09 39.24,51.31 39.24,50.93 R11.2
  Top 0.508: R10.2 R11.2
N$64
  Top 0.508: U1.3 19.88,22.16 19.56,21.84
  Top 1.016: L1.1 20.64,19.23 19.56,20.32 19.56,21.84
N$66
  Top 1.016: C3.2 R8.2 24.26,24 23.2,24 U1.5 22.73,24.48 R9.1
N$123
  Top 0.508: D2.A 31.68,37.47 L2.2 31.68,35.74 30.48,34.54 30.48,32.77 31.05,32.2 U2.1
N$126
  Top 0.508: U2.3 33.08,34.1 R13.1 R12.1
NC
  Top 3.048: RELAY.O 41.15,14.1 CON2.3
  Bottom 3.048: RELAY.O 41.15,14.1 CON2.3
NO
  Top 3.048: CON2.1 41.15,3.94 RELAY.S
  Bottom 3.048: CON2.1 41.15,3.94 RELAY.S
REL  (via drill 0.6)
  Top 0.254: REL.C 14.99,9.4 19.27,9.4 D1.A | 4.45,48.26 4.57,48.39 26.04,48.39 26.8,47.62 26.8,46.61 27.56,45.85 29.46,45.85 v30.86,44.45 | 28.96,15.88 33.15,20.07 v33.15,22.35
  Top 0.508: CON1.17 3.56,47.37 4.45,48.26
  Top 1.016: D1.A 21.34,13.97 T1.3 27.05,13.97 RELAY.2 28.96,15.88
  Bottom 0.254: v30.86,44.45 30.48,44.07 30.48,31.24 31.88,29.84 31.88,28.83 33.15,27.56 v33.15,22.35
RSTB  (via drill 0.6)
  Top 0.254: 11.05,9.53 11.56,10.03 v11.56,11.56
  Top 0.508: v5.08,32.13 CON1.5
  Top 1.016: RST.2 11.05,8.76 11.05,9.53
  Bottom 0.254: 15.37,29.97 15.37,31.88 13.34,33.91 6.86,33.91 v5.08,32.13 | 15.37,28.57 16.26,27.69 16.26,23.88 14.61,22.23 14.61,20.19 13.59,19.18 13.59,13.59 v11.56,11.56
  Bottom 1.016: 15.37,29.97 13.P$1 15.37,28.57
SD_CLK  (via drill 0.6)
  Top 0.508: CON1.9 v5.08,37.21
  Bottom 0.254: 27.69,46.74 26.8,45.85 25.02,45.85 24.51,45.34 22.73,45.34 22.23,44.83 20.45,44.83 19.94,44.32 18.16,44.32 11.81,37.97 5.84,37.97 v5.08,37.21
  Bottom 1.016: 27.69,46.74 5.P$1
SD_CMD
  Bottom 0.254: 20.07,46.74 19.18,45.85 17.4,45.85 11.05,39.5 6.6,39.5 5.46,40.64 4.32,40.64 | CON1.12 3.43,39.75
  Bottom 0.508: 3.43,39.75 4.32,40.64
  Bottom 1.016: 20.07,46.74 8.P$1
SD_D0  (via drill 0.6)
  Top 0.508: CON1.13 v5.08,42.29
  Bottom 0.254: 17.53,46.74 16.13,45.34 7.37,45.34 5.08,43.05 v5.08,42.29
  Bottom 1.016: 17.53,46.74 9.P$1
SD_D1  (via drill 0.6)
  Top 0.508: CON1.11 v5.08,39.75
  Bottom 0.254: 22.61,46.74 21.72,45.85 19.94,45.85 19.43,45.34 17.65,45.34 11.3,38.99 5.84,38.99 v5.08,39.75
  Bottom 1.016: 22.61,46.74 7.P$1
SD_D2
  Bottom 0.254: 25.15,46.74 24.26,45.85 22.48,45.85 21.97,45.34 20.19,45.34 19.68,44.83 17.91,44.83 11.56,38.48 4.7,38.48 | CON1.10 3.43,37.21
  Bottom 0.508: 3.43,37.21 4.7,38.48
  Bottom 1.016: 25.15,46.74 6.P$1
SD_D3
  Bottom 0.254: 14.99,46.74 14.1,45.85 7.11,45.85 4.45,43.18
  Bottom 0.508: CON1.14 3.02,42.8 4.06,42.8 4.45,43.18
  Bottom 1.016: 14.99,46.74 10.P$1
STAT1
  Top 0.254: U3.3 33.78,53.09 R15.1 32.38,54.48 30.73,54.48 29.59,53.34 29.59,49.91 28.57,48.9 4.57,48.9 4.45,49.02
  Top 0.508: CON1.19 3.02,49.4 4.06,49.4 4.45,49.02
STAT2  (via drill 0.6)
  Top 0.254: v34.29,52.07 34.81,52.59 U3.4
  Top 0.508: v34.29,52.07 R14.1
  Bottom 0.254: v34.29,52.07 32.51,50.29 28.45,50.29 27.56,49.4 4.57,49.4
  Bottom 0.508: CON1.20 3.02,49.4 4.57,49.4
VBAT  (via drill 0.6)
  Top 0.254: U3.10 42.05,54.09 C8.1 41.77,53.59 U3.9
  Top 0.508: FET1.3 24.13,34.16 25.27,35.31 R23.2
  Top 0.762: BAT.1 46.85,50.93 44.83,50.93 39.37,45.47 35.05,45.47 31.11,41.53 29.08,41.53 27.94,40.39 25.53,40.39 | R23.2 v25.53,37.97 | R20.1 22.48,40.39 25.53,40.39 | v25.53,40.45 25.53,40.39
  Top 1.016: v42.16,54.99 C8.1
  Bottom 0.762: v25.53,37.97 v25.53,40.45
  Bottom 1.016: BAT.1 45.96,51.2 v42.16,54.99
VCC  (via drill 0.6)
  Top 0.762: 28.32,26.67 28.45,26.8 32.51,26.8 33.02,27.3 38.35,27.3 39.75,28.7 39.75,29.97 v40.89,31.11
  Top 1.016: C4.1 C5.1 C3.1 | C4.1 R8.1 C3.1 | L1.2 23.04,19.3 25.15,19.3 C4.1 | C3.1 27.69,21.08 28.32,21.72 v28.32,23.62 28.32,26.67 v13.21,26.67 10.41,23.88 v10.41,22.86 R1.2 R2.2 R3.2 | v5.08,29.59 CON1.3 | UEXT.1 v5.21,6.73
  Bottom 0.762: v5.21,6.73 7.24,8.76 10.29,8.76 17.4,15.88 17.4,19.05 21.84,23.5 28.19,23.5 v28.32,23.62 | v40.89,31.11 40.89,44.45 1.P$1
  Bottom 1.016: v13.21,26.67 8,26.67 v5.08,29.59

### Text on the board
Top: 115 Errors
Bottom: 106 Errors
tNames: - | + | 19 | + | 17 | 15 | 13 | 11 | 9 | 7 | 5 | 3 | 1 | Only!!! | ESP8266-EVB-BAT | 5VDC | Rev.B | + | 9 | 7 | 5 | 3 | 1 | 188 Errors total
bNames: WWW.OLIMEX.COM | - | (C) 2015 | + | 3.7V | 20 | 18 | 16 | 14 | 12 | 10 | 8 | ESP8266-EVB-BAT | 6 | 4 | 5VDC Only!!! | 2 | 10 | 8 | NC | 6 | COM | 4 | 2 | NO
201bmp: C:/YASSEN_ON_C-YASSEN-REBORN/TASKS/MOD-nRF8001===P/Nordic_NRF8001/nRF8001-Gerber Files/with DCDC/!PICLIST-0909+++.BMP